# Altium schematic sheet Sheet1.SchDoc
size A4
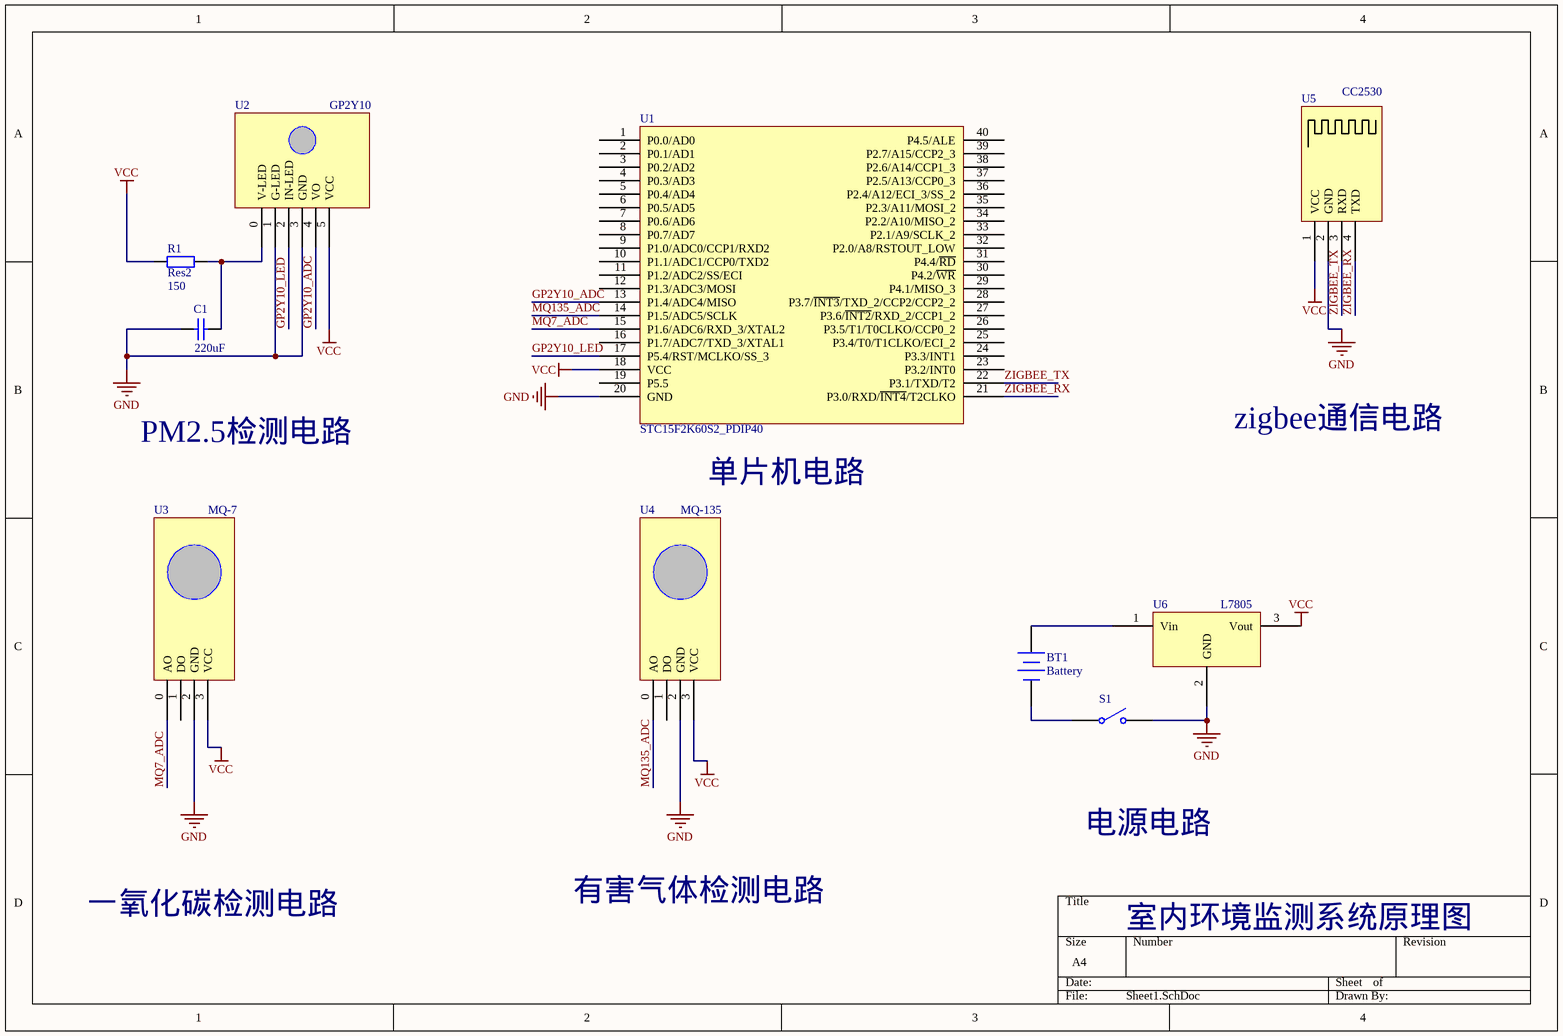
[diagram p0: Sheet1.SchDoc]

## Parts
BT1  Battery  [BAT-2]
C1  value 220uF  [RAD-0.3]  (hidden comment: Cap)
GP2Y10  U2
R1  Res2  value 150  [AXIAL-0.4]
S1  SW-SPST  [SPST-2]  (value not drawn)
U1  STC15F2K60S2_PDIP40  [DIP40]
U3  MQ-7
U4  MQ-135
U5  CC2530
U6  L7805

## Nets
GND: C1.1 GP2Y10.1(G-LED) GP2Y10.3(GND) S1.2(NO) U1.20(GND) U3.2(GND) U4.2(GND) U5.2(GND) U6.2(GND)
VCC: GP2Y10.5(VCC) R1.1 U1.18(VCC) U3.3(VCC) U4.3(VCC) U5.1(VCC) U6.3(Vout)
GP2Y10_ADC: GP2Y10.4(VO) U1.13(P1.4/ADC4/MISO)
GP2Y10_LED: GP2Y10.2(IN-LED) U1.17(P5.4/RST/MCLKO/SS_3)
MQ7_ADC: U1.15(P1.6/ADC6/RXD_3/XTAL2) U3.0(AO)
MQ135_ADC: U1.14(P1.5/ADC5/SCLK) U4.0(AO)
ZIGBEE_RX: U1.21(P3.0/RXD/~{INT4}/T2CLKO) U5.4(TXD)
ZIGBEE_TX: U1.22(P3.1/TXD/T2) U5.3(RXD)
NetBT1_1: BT1.1(+) U6.1(Vin)
NetBT1_2: BT1.2(-) S1.1(COMMON)
NetC1_2: C1.2 GP2Y10.0(V-LED) R1.2

Not connected (* = marked no-connect by the designer): U1 1(P0.0/AD0) 2(P0.1/AD1) 3(P0.2/AD2) 4(P0.3/AD3) 5(P0.4/AD4) 6(P0.5/AD5) 7(P0.6/AD6) 8(P0.7/AD7) 9(P1.0/ADC0/CCP1/RXD2) 10(P1.1/ADC1/CCP0/TXD2) 11(P1.2/ADC2/SS/ECI) 12(P1.3/ADC3/MOSI) 16(P1.7/ADC7/TXD_3/XTAL1) 19(P5.5) 23(P3.2/INT0) 24(P3.3/INT1) 25(P3.4/T0/T1CLKO/ECI_2) 26(P3.5/T1/T0CLKO/CCP0_2) 27(P3.6/~{INT2}/RXD_2/CCP1_2) 28(P3.7/~{INT3}/TXD_2/CCP2/CCP2_2) 29(P4.1/MISO_3) 30(P4.2/~{WR}) 31(P4.4/~{RD}) 32(P2.0/A8/RSTOUT_LOW) 33(P2.1/A9/SCLK_2) 34(P2.2/A10/MISO_2) 35(P2.3/A11/MOSI_2) 36(P2.4/A12/ECI_3/SS_2) 37(P2.5/A13/CCP0_3) 38(P2.6/A14/CCP1_3) 39(P2.7/A15/CCP2_3) 40(P4.5/ALE); U3 1(DO); U4 1(DO)

## Notes on the sheet
- PM2.5检测电路
- zigbee通信电路
- 单片机电路
- 电源电路
- 一氧化碳检测电路
- 有害气体检测电路
- 室内环境监测系统原理图

## Library data of the parts
BT1 = Battery: Multicell Battery; Published: 24-Mar-1999; LatestRevisionDate: 17-Jul-2002; LatestRevisionNote: Re-released for DXP Platform.; PackageReference: BAT-2; Publisher: Altium Limited; PackageDescription: Battery; 2 Leads
C1 = Cap: Capacitor; Published: 8-Jun-2000; LatestRevisionDate: 17-Jul-2002; LatestRevisionNote: Re-released for DXP Platform.; PackageReference: RAD-0.3; Publisher: Altium Limited; PackageDescription: Radial Cap, Thru-Hole; 2 Leads; 0.3 in Pin Spacing
GP2Y10 = GP2Y10
R1 = Res2: Resistor; Published: 8-Jun-2000; LatestRevisionDate: 17-Jul-2002; LatestRevisionNote: Re-released for DXP Platform.; PackageReference: AXIAL-0.4; Publisher: Altium Limited; PackageDescription: Axial Device, Thru-Hole; 2 Leads; 0.4 in Pin Spacing
S1 = SW-SPST: Single-Pole, Single-Throw Switch; Published: 24-Mar-1999; LatestRevisionDate: 17-Jul-2002; LatestRevisionNote: Re-released for DXP Platform.; PackageReference: SPST-2; Publisher: Altium Limited; PackageDescription: Switch; 2 Leads
U3 U4 = MQ-